# Altium schematic sheet 23 I2C WRAP.SchDoc
size 297 x 209 mm
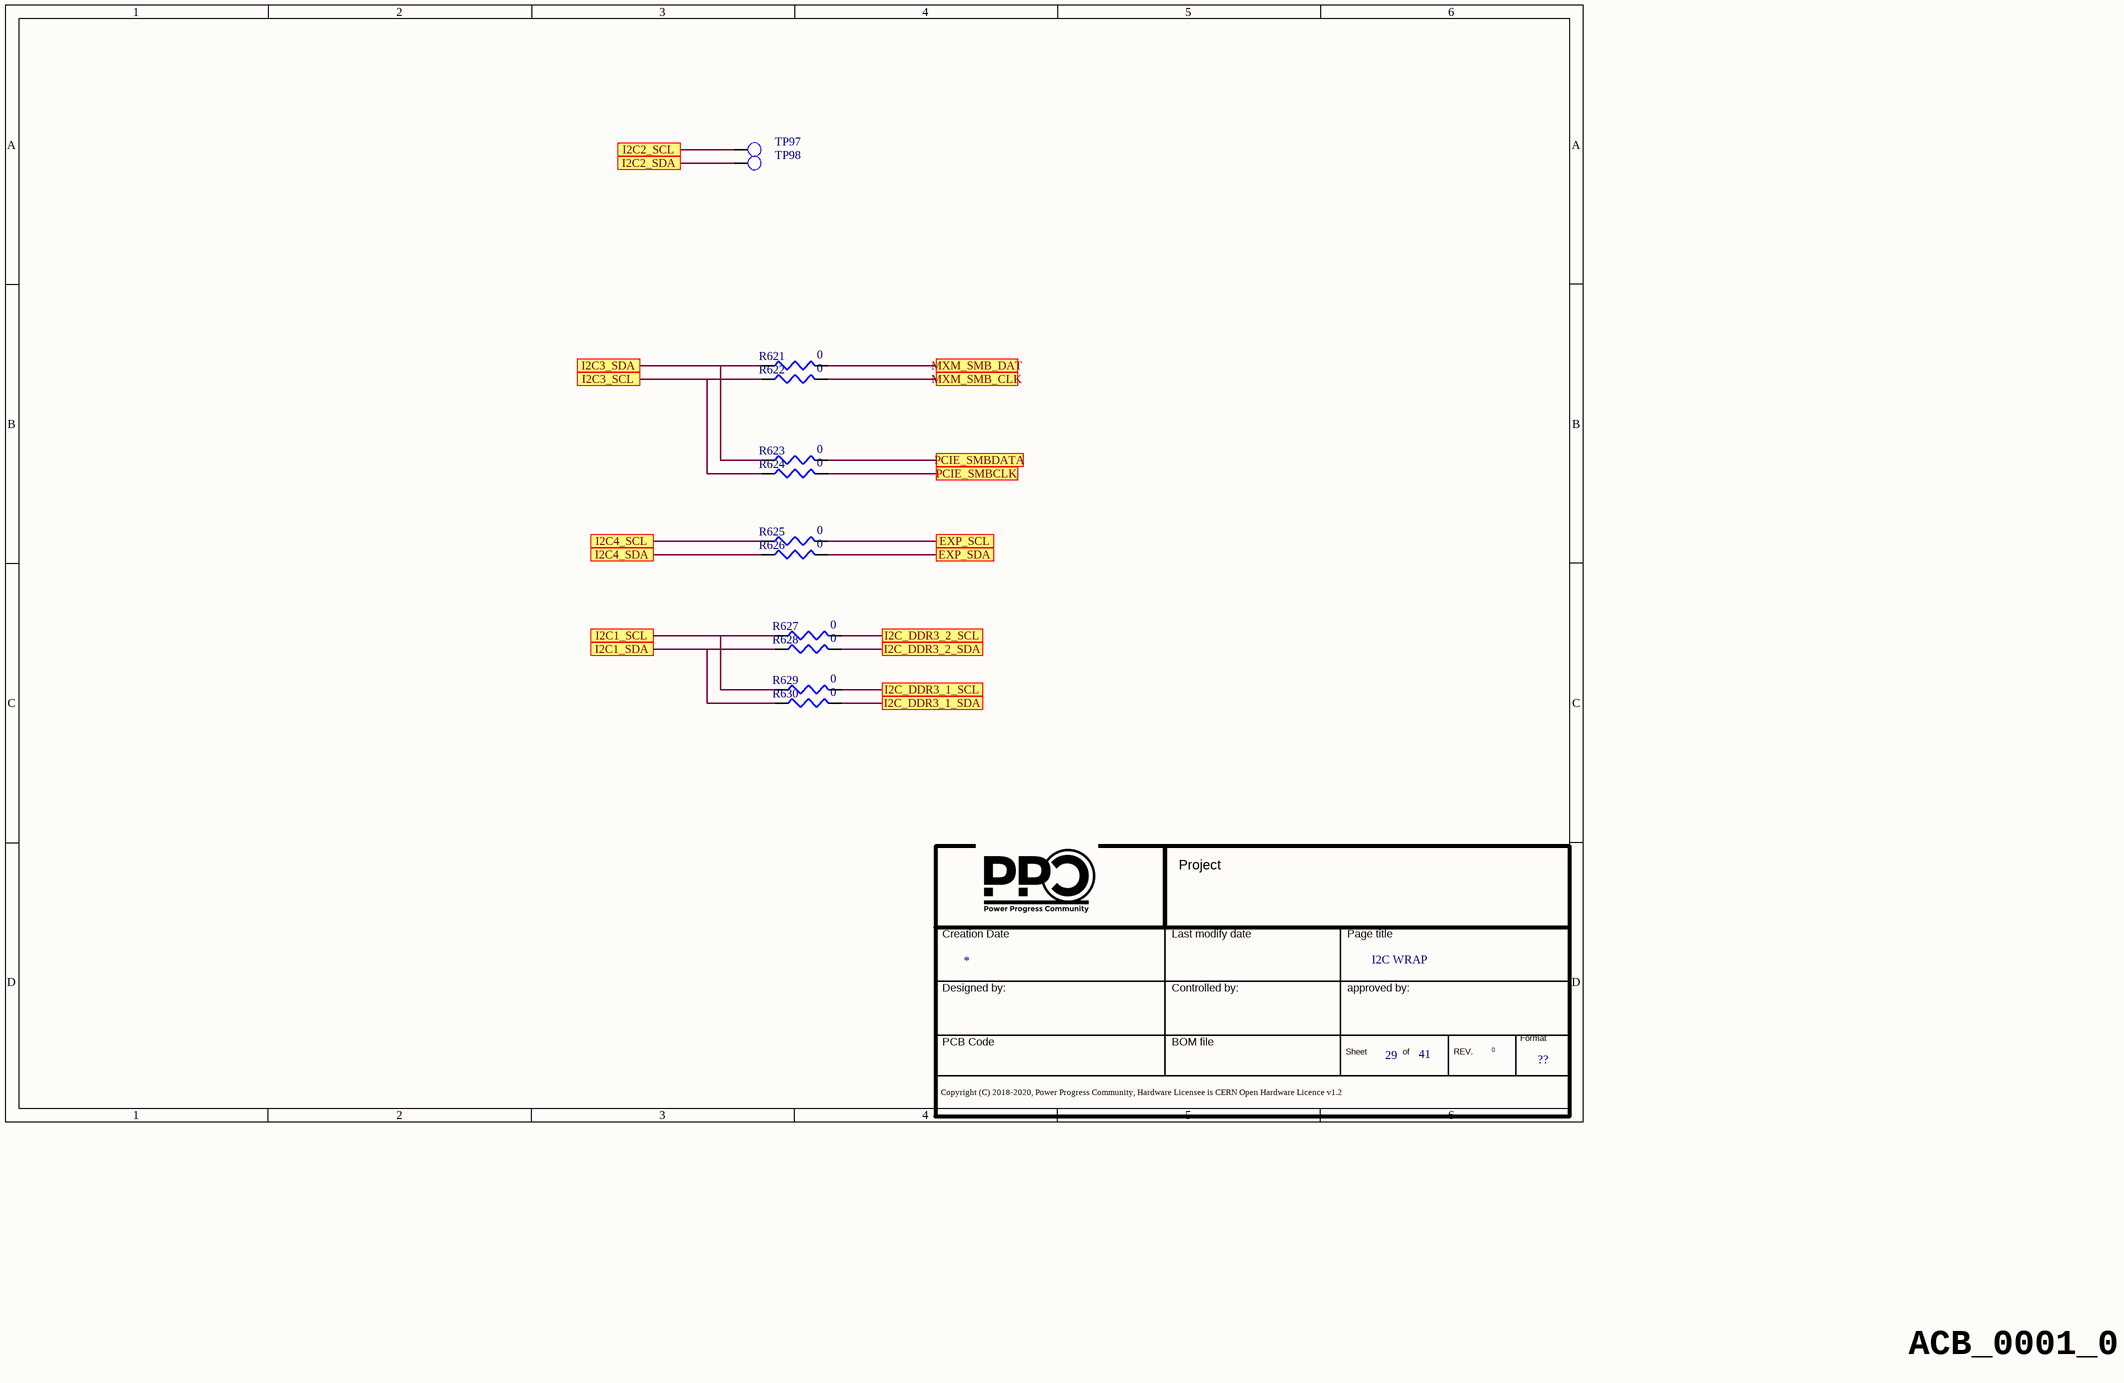
[diagram p0: 23 I2C WRAP.SchDoc]

## Parts
*  Doc: I2C WRAP  Page Count: 41  Page Number: 29  Page Size: ??  RevCode: 0  (hidden comment: Title_block_PPC)  (graphical)
R621  0  [SMD_0402]
R622  0  [SMD_0402]
R623  0  [SMD_0402]
R624  0  [SMD_0402]
R625  0  [SMD_0402]
R626  0  [SMD_0402]
R627  0  [SMD_0402]
R628  0  [SMD_0402]
R629  0  [SMD_0402]
R630  0  [SMD_0402]
TP97  TEST POINT  [PCB]  (value not drawn)
TP98  TEST POINT  [PCB]  (value not drawn)

## Ports
EXP_SCL, EXP_SDA, I2C1_SCL, I2C1_SDA, I2C2_SCL, I2C2_SDA, I2C3_SCL, I2C3_SDA, I2C4_SCL, I2C4_SDA, I2C_DDR3_1_SCL, I2C_DDR3_1_SDA, I2C_DDR3_2_SCL, I2C_DDR3_2_SDA, MXM_SMB_CLK, MXM_SMB_DAT, PCIE_SMBCLK, PCIE_SMBDATA

## Nets
EXP_SCL: R625.2 ; port EXP_SCL
EXP_SDA: R626.2 ; port EXP_SDA
I2C1_SCL: R627.1 R629.1 ; port I2C1_SCL
I2C1_SDA: R628.1 R630.1 ; port I2C1_SDA
I2C2_SCL: TP97.1(TP) ; port I2C2_SCL
I2C2_SDA: TP98.1(TP) ; port I2C2_SDA
I2C3_SCL: R622.1 R624.1 ; port I2C3_SCL
I2C3_SDA: R621.1 R623.1 ; port I2C3_SDA
I2C4_SCL: R625.1 ; port I2C4_SCL
I2C4_SDA: R626.1 ; port I2C4_SDA
I2C_DDR3_1_SCL: R629.2 ; port I2C_DDR3_1_SCL
I2C_DDR3_1_SDA: R630.2 ; port I2C_DDR3_1_SDA
I2C_DDR3_2_SCL: R627.2 ; port I2C_DDR3_2_SCL
I2C_DDR3_2_SDA: R628.2 ; port I2C_DDR3_2_SDA
MXM_SMB_CLK: R622.2 ; port MXM_SMB_CLK
MXM_SMB_DAT: R621.2 ; port MXM_SMB_DAT
PCIE_SMBCLK: R624.2 ; port PCIE_SMBCLK
PCIE_SMBDATA: R623.2 ; port PCIE_SMBDATA

## Notes on the sheet
- ACB_0001_0
- (in symbol Title_block_PPC) Project; Creation Date; Last modify date; Page title; Designed by:; Controlled by:; approved by:; PCB Code; BOM file; Format; Sheet; of; REV.; Copyright (C) 2018-2020, Power Progress Community, Hardware Licensee is CERN Open Hardware Licence v1.2

## Library data of the parts
* = Title_block_PPC: Title: T2080PCIe; Schematic Page Count: 45; Schematic Page Number: 32; Author: MICETEK; Page Create Date: March  8, 1995; Page Title: ?; Page Modify Date: *
R621 R622 R624-R626 = R_Dup5: RESIS.CHIP 0R 5% 0402 SMD; Part Number: PASSIVE_805; Manufacturer 1: ROYAL OHM; RSM: RC0402; Part Type: Resistors\Fixed\SMD\0402\5%; Manufacturer Part Number 1: RESIS.CHIP 0R 5% 0402 SMD; Distributor 1: CAMEL ELETTRONICA SRL  #; PCB Footprint: SMD_0402
R623 R627-R630 = R_Dup5: RESIS.CHIP 0R 5% 0402 SMD; Manufacturer 1: ROYAL OHM; Part Number: PASSIVE_805; RSM: RC0402; Distributor 1: CAMEL ELETTRONICA SRL  #; Manufacturer Part Number 1: RESIS.CHIP 0R 5% 0402 SMD; Part Type: Resistors\Fixed\SMD\0402\5%; PCB Footprint: SMD_0402
TP97 TP98 = T POINT R: TEST POINT SU PCB; Part Number: CONNECTORS_542; RSM: AE-TESTPOINT; PCB Footprint: PCB; Part Type: Tpoint